# EAGLE design chronos (EAGLE 5.08)

## Sheet 1 of 2
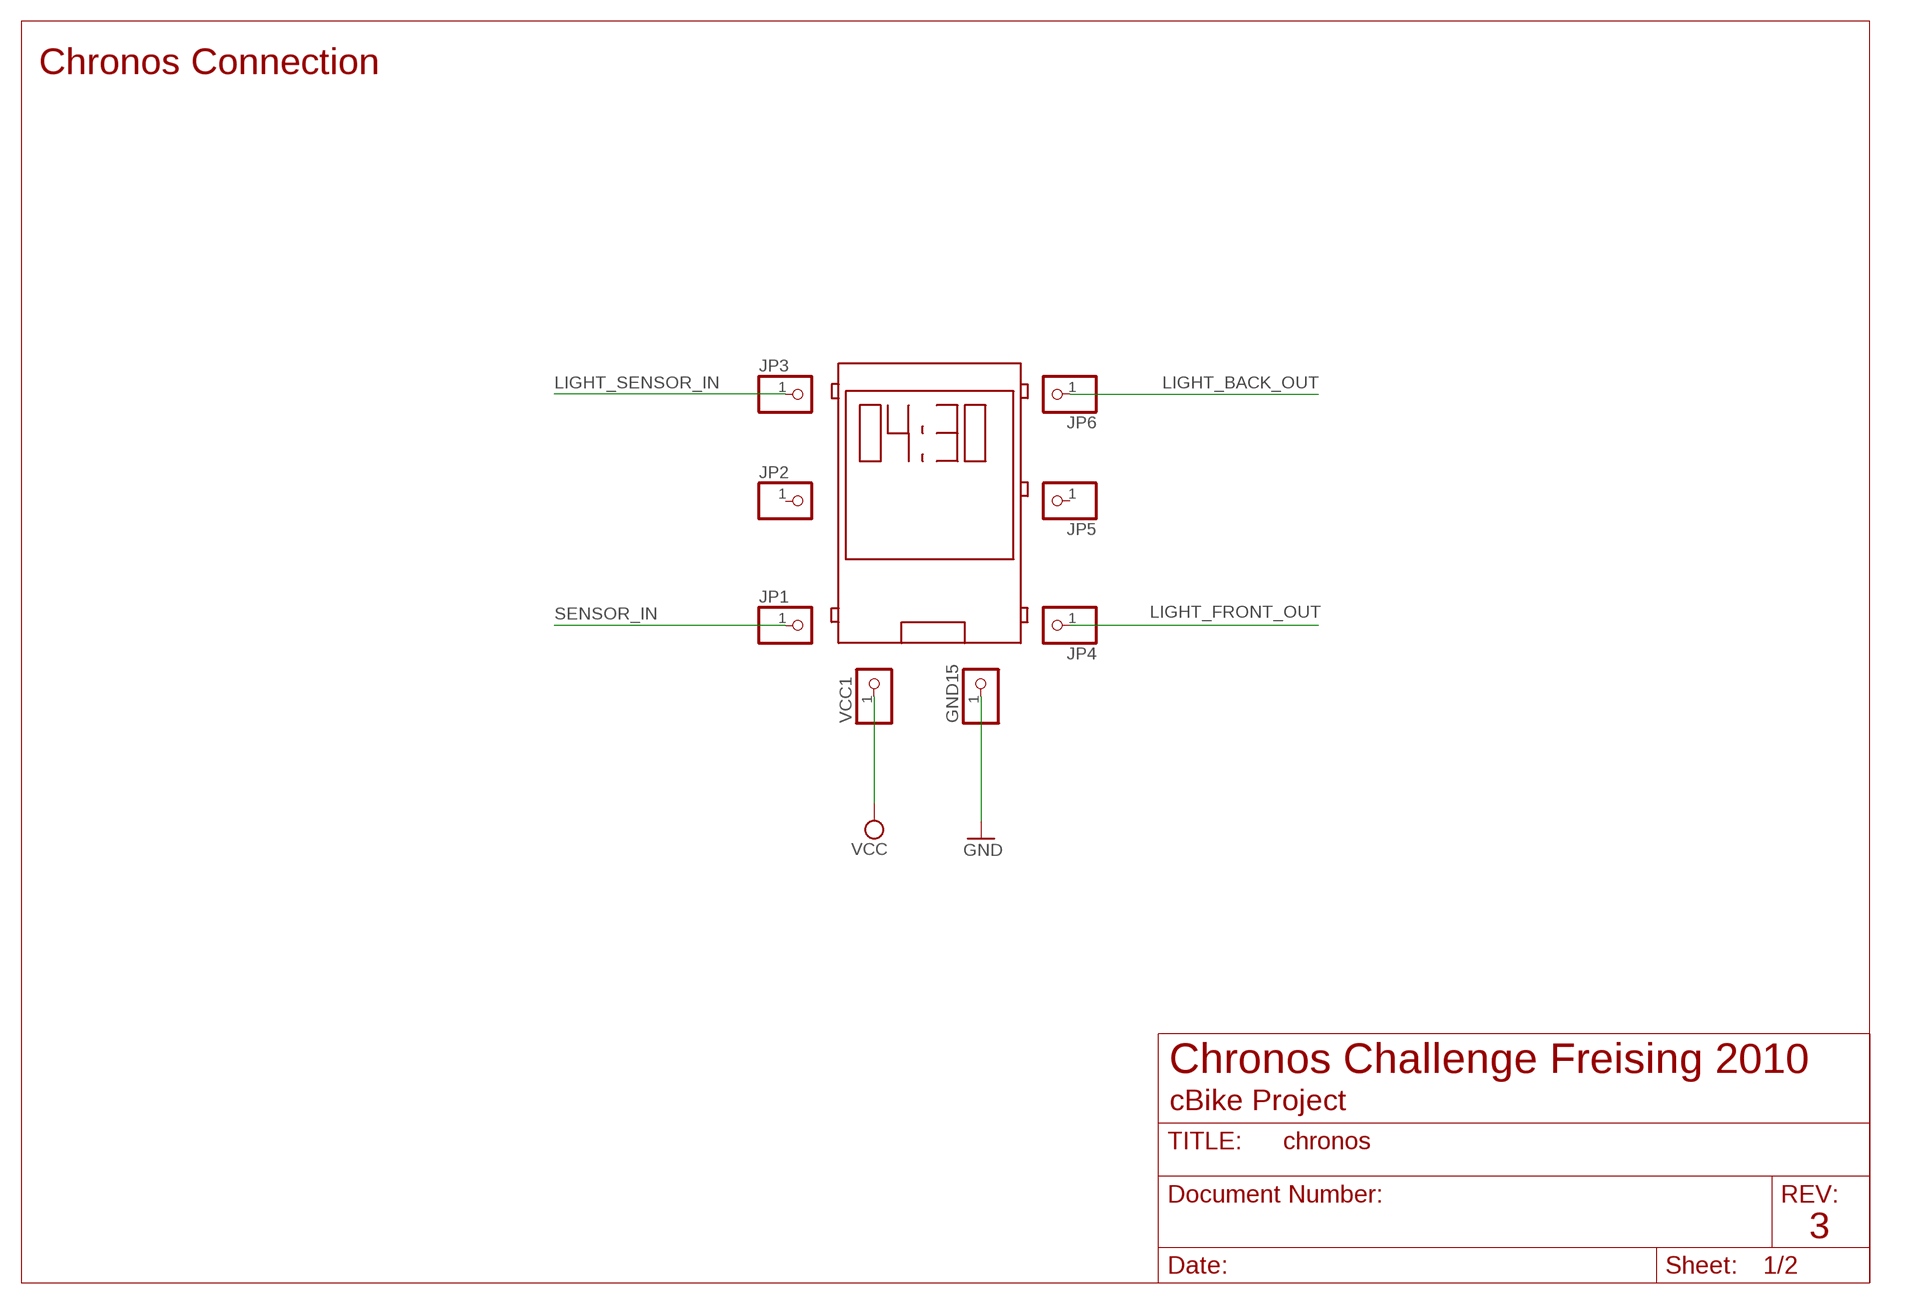
[diagram p0: schematic, sheet 1]

### Parts
GND15  PINHD-1X1  [1X01]
JP1  PINHD-1X1  [1X01]
JP2  PINHD-1X1  [1X01]
JP3  PINHD-1X1  [1X01]
JP4  PINHD-1X1  [1X01]
JP5  PINHD-1X1  [1X01]
JP6  PINHD-1X1  [1X01]
U$2  CHRONOS  [CHRONOS]
VCC1  PINHD-1X1  [1X01]

### Nets
GND: GND15.1 ; also sheet 2
LIGHT_BACK_OUT: JP6.1 ; also sheet 2
LIGHT_FRONT_OUT: JP4.1 ; also sheet 2
LIGHT_SENSOR_IN: JP3.1 ; also sheet 2
SENSOR_IN: JP1.1 ; also sheet 2
VCC: VCC1.1 ; also sheet 2
Unconnected: JP2.1 JP5.1

### Notes on the sheet
- Chronos Connection
- Chronos Challenge Freising 2010
- cBike Project
- 3

## Sheet 2 of 2
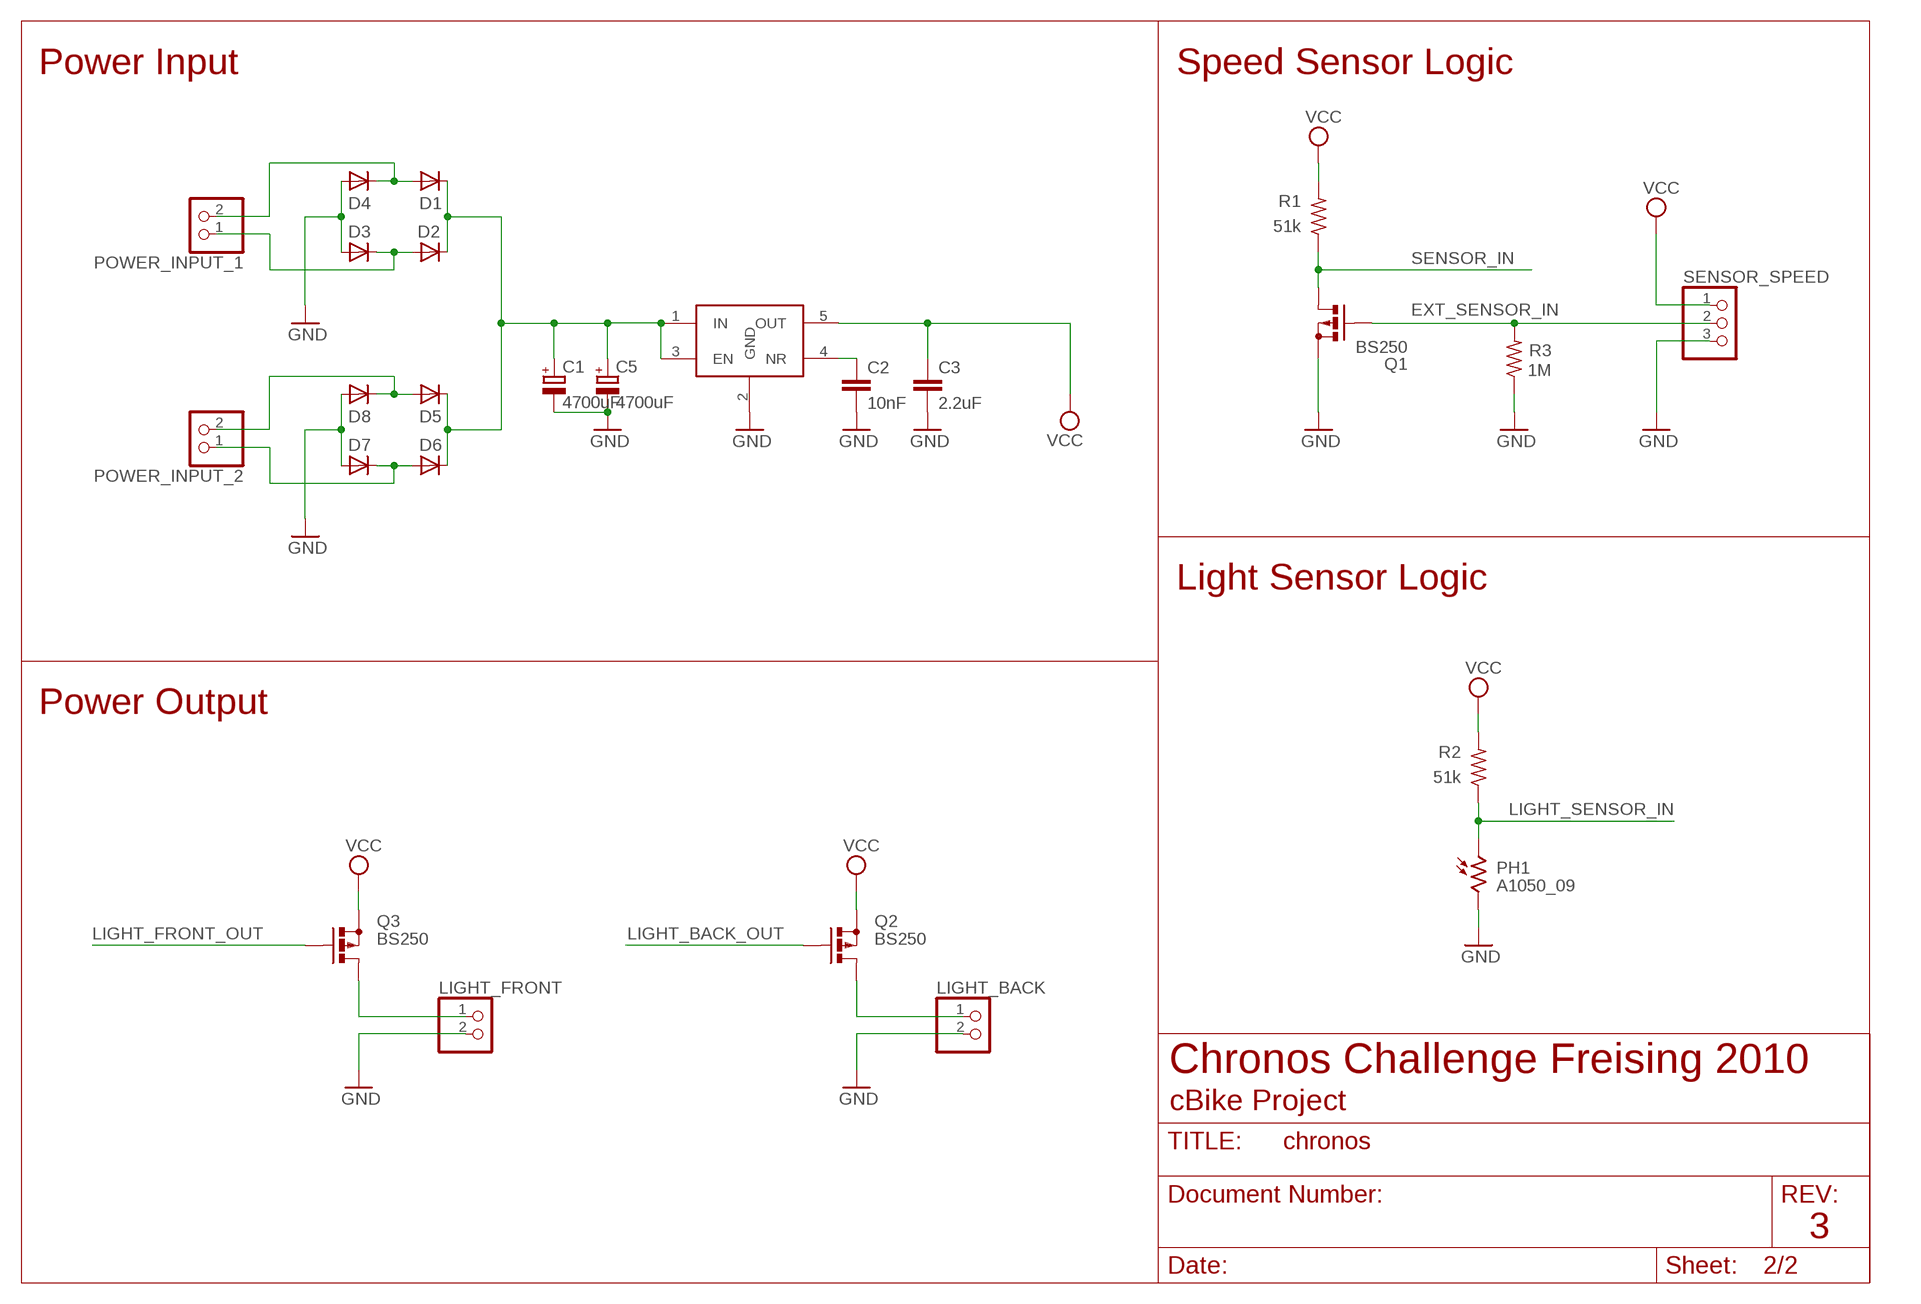
[diagram p1: schematic, sheet 2]

### Parts
C1  4700uF  CPOL-EUE5-13  [E5-13]
C2  10nF  C-EUC0805  [C0805]
C3  2.2uF  C-EUC0805  [C0805]
C5  4700uF  CPOL-EUE5-13  [E5-13]
D1  PMLL4150  [SOD80C]
D2  PMLL4150  [SOD80C]
D3  PMLL4150  [SOD80C]
D4  PMLL4150  [SOD80C]
D5  PMLL4150  [SOD80C]
D6  PMLL4150  [SOD80C]
D7  PMLL4150  [SOD80C]
D8  PMLL4150  [SOD80C]
LIGHT_BACK  PINHD-1X2  [1X02]
LIGHT_FRONT  PINHD-1X2  [1X02]
PH1  A1050_09  [T0-46-A10XX]
POWER_INPUT_1  PINHD-1X2  [1X02]
POWER_INPUT_2  PINHD-1X2  [1X02]
Q1  BS250  [SOT54E]
Q2  BS250  [SOT54E]
Q3  BS250  [SOT54E]
R1  51k  R-US_R0805  [R0805]
R2  51k  R-US_R0805  [R0805]
R3  1M  R-US_R0805  [R0805]
SENSOR_SPEED  PINHD-1X3  [1X03]
TPS9333  TPS79333  [SOT23-5]

### Nets
EXT_SENSOR_IN: Q1.G R3.2 SENSOR_SPEED.2
GND: C1.- C2.2 C3.2 C5.- D3.A D4.A D7.A D8.A LIGHT_BACK.2 LIGHT_FRONT.2 PH1.2 Q1.S R3.1 SENSOR_SPEED.3 TPS9333.2(GND) ; also sheet 1
LIGHT_BACK_OUT: Q2.G ; also sheet 1
LIGHT_FRONT_OUT: Q3.G ; also sheet 1
LIGHT_SENSOR_IN: PH1.1 R2.1 ; also sheet 1
N$2: LIGHT_BACK.1 Q2.D
N$3: C2.1 TPS9333.4(NR)
N$5: LIGHT_FRONT.1 Q3.D
N$6: D6.A D7.C POWER_INPUT_2.1
N$7: C1.+ C5.+ D1.C D2.C D5.C D6.C TPS9333.1(IN) TPS9333.3(EN)
N$8: D2.A D3.C POWER_INPUT_1.1
N$20: D5.A D8.C POWER_INPUT_2.2
N$21: D1.A D4.C POWER_INPUT_1.2
SENSOR_IN: Q1.D R1.1 ; also sheet 1
VCC: C3.1 Q2.S Q3.S R1.2 R2.2 SENSOR_SPEED.1 TPS9333.5(OUT) ; also sheet 1

### Notes on the sheet
- Power Input | Speed Sensor Logic
- Light Sensor Logic
- Power Output
- Chronos Challenge Freising 2010
- cBike Project
- 3

## Library data of the parts
C1 C5 = rcl:CPOL-EU: POLARIZED CAPACITOR, European symbol
C2 C3 = resistor:C-EU: CAPACITOR, European symbol
D1-D8 = diode:PMLL4150: DIODE high speed
GND15 JP1-JP6 VCC1 = pinhead:PINHD-1X1: PIN HEADER
LIGHT_BACK LIGHT_FRONT POWER_INPUT_1 POWER_INPUT_2 = pinhead:PINHD-1X2: PIN HEADER
PH1 = photo-elements:A10: Sensor Robust Light Sensing Applications Outdoor Light Sensing Application Source: http://optoelectronics.perkinelmer.com/content/Datasheets/DTS_PhotocellsA1050.pdf
Q1-Q3 = transistor-small-signal:BS250: P-CHANNEL MOS FET
R1-R3 = resistor:R-US_: RESISTOR, American symbol
SENSOR_SPEED = pinhead:PINHD-1X3: PIN HEADER
TPS9333 = chronos:TPS79333
U$2 = chronos:CHRONOS

## Board
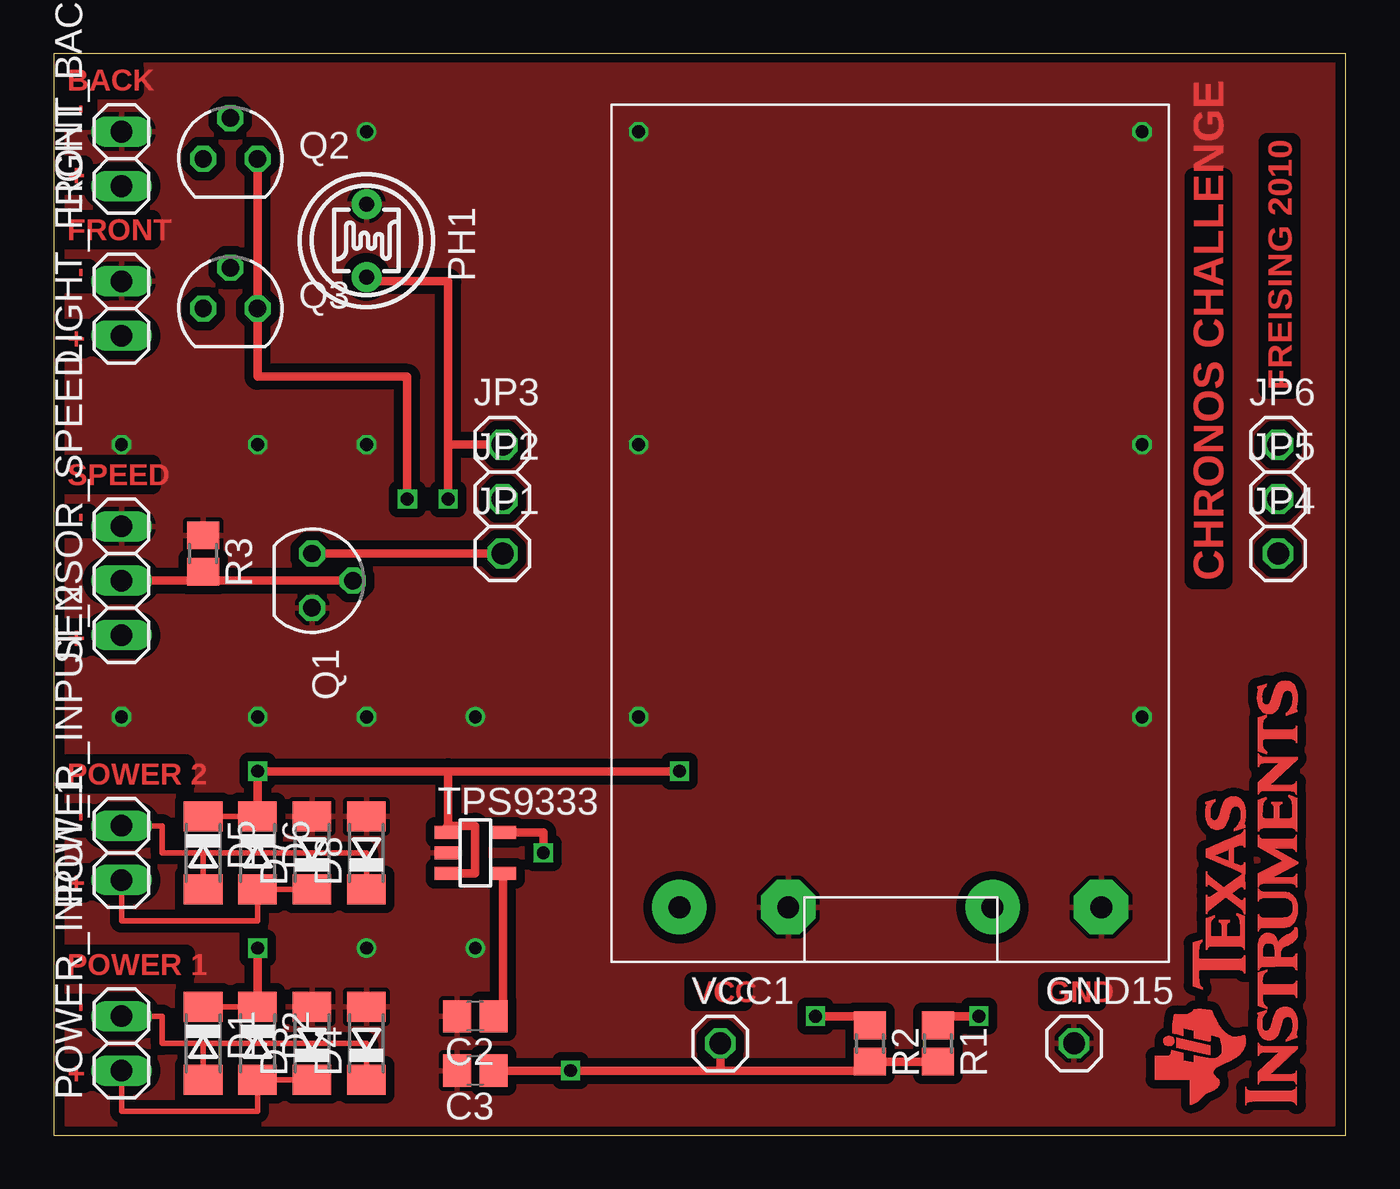
[diagram p2: board, top side]
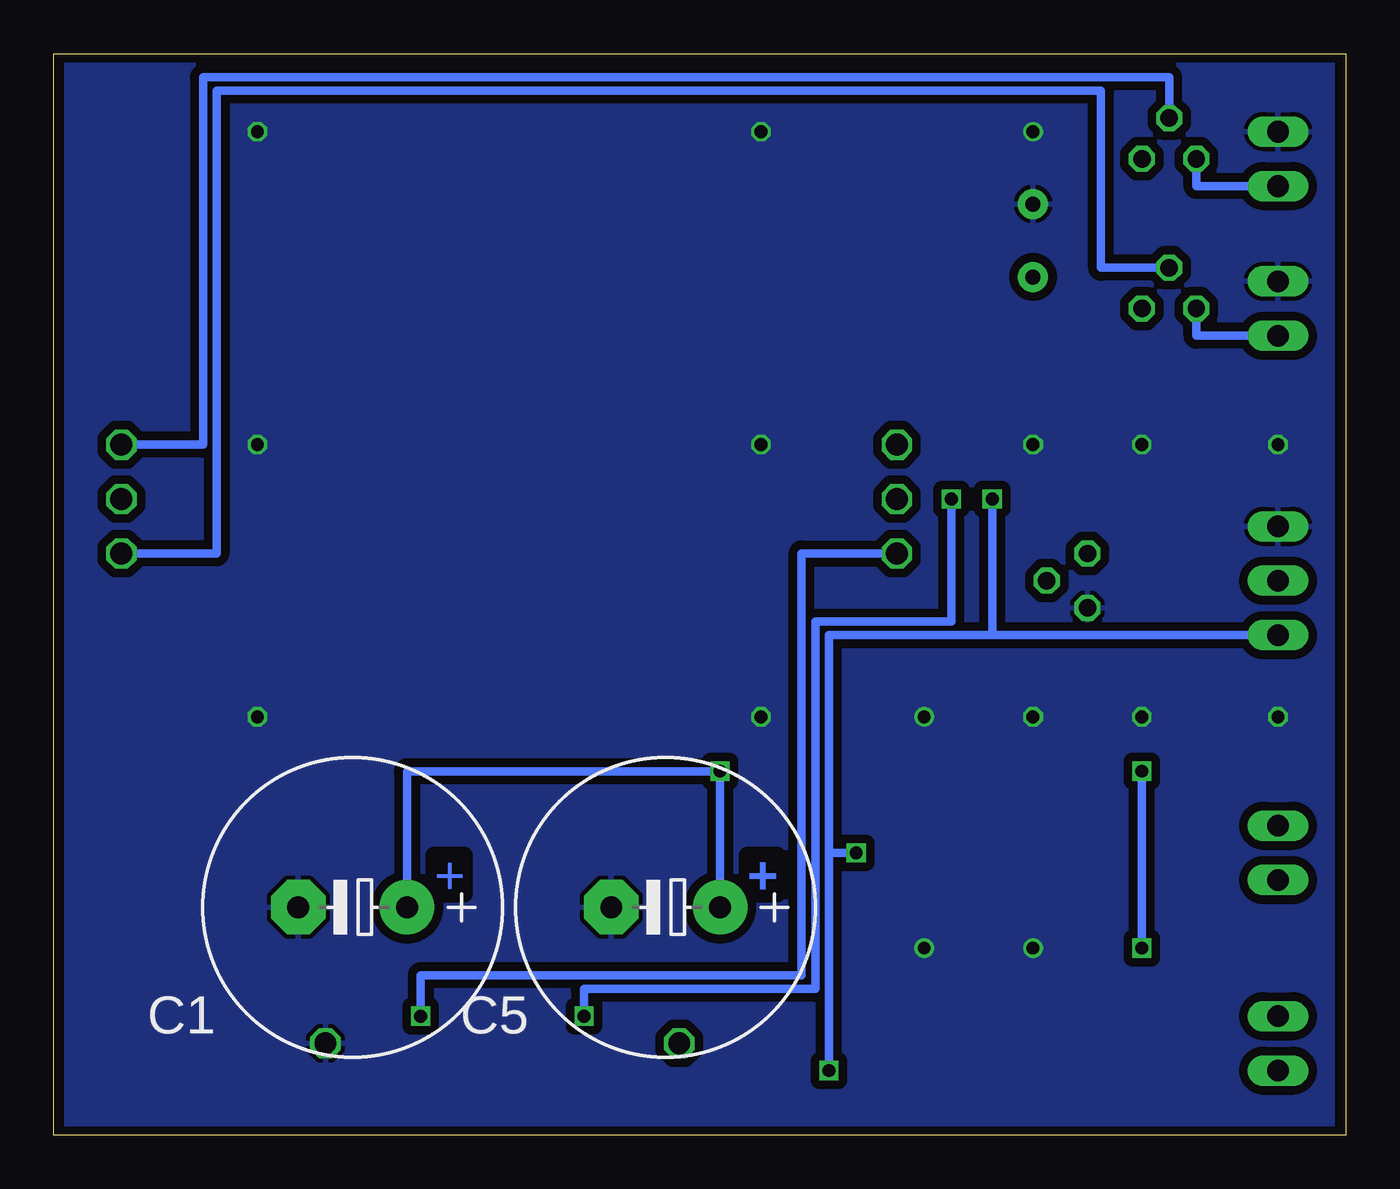
[diagram p3: board, bottom side, seen from below]

Size 60.3 x 50.47 mm. Coordinates in mm from the lower left corner, seen from the top.
Outline: 0,0 60.3,0 60.3,50.47 0,50.47 0,0
Copper layers (1*16): Top 0.035mm / dielectric 1.5mm / Bottom 0.035mm
Design rules "PCB-POOL Standard": minimum track width 0.15mm, minimum drill 0.3mm, track to track 0.15mm, track to pad 0.15mm, pad to pad 0.15mm, via to via 0.15mm, smd to smd 0.15mm, copper to edge 0.3mm, drill to drill 0.2mm, minimum pad ring 0.2mm, minimum via ring 0.15mm, stop-mask expansion 0.075mm, vias tented up to drill 0mil, thermal gap 0.2mm

### Footprints (pad centres in the part's own frame; a part is rotated, then mirrored left to right if it is on the bottom)
E5-13 = drill 1.016 pad 2.54 round: + -2.54,0 | drill 1.016 pad 2.54 octagon: - 2.54,0
C0805 = smd 1.3 x 1.5: 1 -0.85,0; 2 0.85,0
SOD80C = smd 1.4 x 1.8: A 1.7,0; C -1.7,0
1X01 = drill 1.016 octagon: 1 0,0
1X02 = drill 1.016 long: 1 -1.27,0; 2 1.27,0
T0-46-A10XX = drill 0.7 pad 1.4 round: 1 -1.7,0; 2 1.7,0
SOT54E = drill 0.813 octagon: D -1.27,0; G 0,1.905; S 1.27,0
R0805 = smd 1.3 x 1.5: 1 -0.85,0; 2 0.85,0
1X03 = drill 1.016 long: 1 -2.54,0; 2 0,0; 3 2.54,0
SOT23-5 = smd 0.6 x 1.2: 1 -0.95,-1.306; 2 0,-1.306; 3 0.95,-1.306; 4 0.95,1.306; 5 -0.95,1.306

### Placement (x,y rotation side)
C1  46.35,10.63 180 bottom
C2  19.68,5.55 180 top
C3  19.68,3.01 180 top
C5  31.74,10.63 180 bottom
D1  6.98,4.28 270 top
D2  9.52,4.28 270 top
D3  12.06,4.28 90 top
D4  14.6,4.28 90 top
D5  6.98,13.17 270 top
D6  9.52,13.17 270 top
D7  12.06,13.17 90 top
D8  14.6,13.17 90 top
GND15  47.62,4.28 0 top
JP1  20.95,27.14 0 top
JP2  20.95,29.68 0 top
JP3  20.95,32.22 0 top
JP4  57.15,27.14 0 top
JP5  57.15,29.68 0 top
JP6  57.15,32.22 0 top
LIGHT_BACK  3.17,45.55 90 top
LIGHT_FRONT  3.17,38.57 90 top
PH1  14.6,41.74 90 top
POWER_INPUT_1  3.17,4.28 90 top
POWER_INPUT_2  3.17,13.17 90 top
Q1  12.06,25.87 270 top
Q2  8.25,45.55 0 top
Q3  8.25,38.57 0 top
R1  41.27,4.28 270 top
R2  38.1,4.28 270 top
R3  6.98,27.14 270 top
SENSOR_SPEED  3.17,25.87 90 top
TPS9333  19.68,13.17 270 top
U$2  26.03,8.09 0 top
U$3  [TI_20X7MM]  58.05,1.39 90 top
VCC1  31.11,4.28 0 top

### Tracks (layer width: path | path; a pad name or v marks a point on that pad's centre or on a via)
EXT_SENSOR_IN
  Top 0.406: SENSOR_SPEED.2 6.98,25.87 | 6.98,25.87 Q1.G | 6.98,25.87 R3.2
GND  (via drill 0.6)
  other vias: 3.17,19.52 9.52,19.52 14.6,19.52 9.52,32.22 14.6,32.22 27.3,19.52 3.17,32.22 19.68,8.73 19.68,19.52 14.6,46.82 27.3,32.22 14.6,8.73 50.8,19.52 50.8,32.22 50.8,46.82 27.3,46.82
  pour Top (isolate 0.406): 0.63,0.47 0.63,50 59.69,50 59.69,0.47
  pour Bottom (isolate 0.406): 0.63,0.47 0.63,50 59.69,50 59.69,0.47
LIGHT_BACK_OUT
  Bottom 0.406: Q2.G 8.25,49.37 53.34,49.37 53.34,32.22 JP6.1
LIGHT_FRONT_OUT
  Bottom 0.406: JP4.1 52.7,27.14 52.7,48.73 11.43,48.73 11.43,40.48 Q3.G
LIGHT_SENSOR_IN  (via drill 0.6)
  Top 0.406: v35.55,5.55 38.1,5.55 R2.1 | v18.41,29.68 18.41,32.22 | 18.41,32.22 18.41,39.84 14.6,39.84 PH1.1 | 18.41,32.22 JP3.1
  Bottom 0.406: v35.55,5.55 35.55,6.82 24.76,6.82 24.76,23.96 18.41,23.96 v18.41,29.68
N$2
  Bottom 0.406: Q2.D 6.98,44.28 LIGHT_BACK.1
N$3
  Top 0.406: C2.1 20.99,5.55 TPS9333.4
N$5
  Bottom 0.406: Q3.D 6.98,37.3 LIGHT_FRONT.1
N$6
  Top 0.254: D7.C D6.A 9.52,10 3.17,10 POWER_INPUT_2.1
N$7  (via drill 0.6)
  Top 0.254: D1.C D2.C | D5.C D6.C 9.52,14.44
  Top 0.406: TPS9333.3 19.68,12.22 19.68,14.44 18.41,14.44 | 18.41,14.44 18.37,14.44 TPS9333.1 18.41,14.12 18.41,14.44 | D2.C v9.52,8.73 | 18.41,16.98 v9.52,16.98 D6.C | 18.41,16.98 18.41,14.44 | 18.41,16.98 v29.2,16.98
  Bottom 0.406: v9.52,8.73 v9.52,16.98 | C5.+ v29.2,16.98 43.81,16.98 C1.+
N$8
  Top 0.254: POWER_INPUT_1.1 3.17,1.1 9.52,1.1 D2.A D3.C 12.06,2.38
N$20
  Top 0.254: POWER_INPUT_2.2 5.08,14.44 5.08,13.17 6.98,13.17 | D5.A 6.98,13.17 | 6.98,13.17 14.6,13.17 D8.C
N$21
  Top 0.254: POWER_INPUT_1.2 5.08,5.55 5.08,4.28 6.98,4.28 | D1.A 6.98,4.28 | 14.6,2.38 D4.C 14.6,4.28 6.98,4.28
SENSOR_IN  (via drill 0.6)
  Top 0.406: v43.18,5.55 41.27,5.55 R1.1 | JP1.1 Q1.D
  Bottom 0.406: JP1.1 25.39,27.14 25.39,7.46 43.18,7.46 v43.18,5.55
VCC  (via drill 0.6)
  Top 0.406: Q2.S Q3.S 9.52,35.39 16.5,35.39 v16.5,29.68 | C3.1 v24.12,3.01 31.11,3.01 | TPS9333.5 22.86,14.12 v22.86,13.17 | 31.11,3.01 38.1,3.01 R2.2 R1.2 41.27,3.01 | 31.11,3.01 VCC1.1
  Bottom 0.406: v24.12,3.01 24.12,13.17 | 24.12,13.17 24.12,23.33 16.5,23.33 | 24.12,13.17 v22.86,13.17 | 16.5,23.33 SENSOR_SPEED.1 | 16.5,23.33 v16.5,29.68

### Text on the board
Top: - | BACK | + | FRONT | - | + | FREISING 2010 | SPEED | - | CHRONOS CHALLENGE | + | POWER 2 | - | + | POWER 1 | - | VCC | GND | +
Bottom: + | +